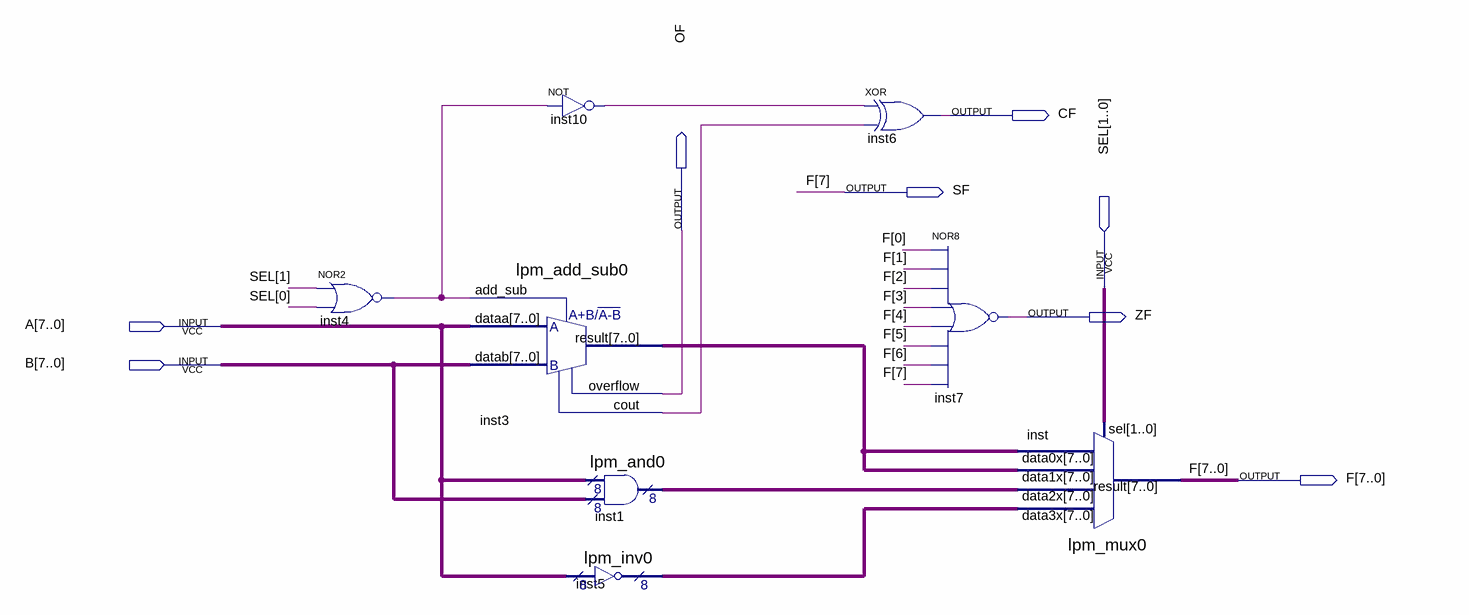
[diagram p0: schematic sheet]
// Quartus schematic ALU.bdf as structural Verilog: 8 symbols, 8 pins
module ALU (
  input  [1:0] SEL,
  input  [7:0] A,
  input  [7:0] B,
  output CF,
  output SF,
  output OF,
  output ZF,
  output [7:0] F
);

  wire inst3_cout, inst4_out, inst10_out;
  wire [7:0] inst1_result, inst3_result, inst5_result;

  nor inst4 (inst4_out, SEL[1], SEL[0]);
  lpm_add_sub0 inst3 (
    .dataa(A), .datab(B), .add_sub(inst4_out), .result(inst3_result), .overflow(OF), .cout(inst3_cout));
  not inst10 (inst10_out, inst4_out);
  lpm_and0 inst1 (.data0x(A), .data1x(B), .result(inst1_result));
  lpm_inv0 inst5 (.data(A), .result(inst5_result));
  xor inst6 (CF, inst10_out, inst3_cout);
  nor inst7 (ZF, F[0], F[1], F[2], F[3], F[4], F[5], F[6], F[7]);
  lpm_mux0 inst (
    .data3x(inst5_result), .data2x(inst1_result), .data1x(inst3_result), .data0x(inst3_result), .sel(SEL),
    .result(F));

  assign SF = F[7];
endmodule
